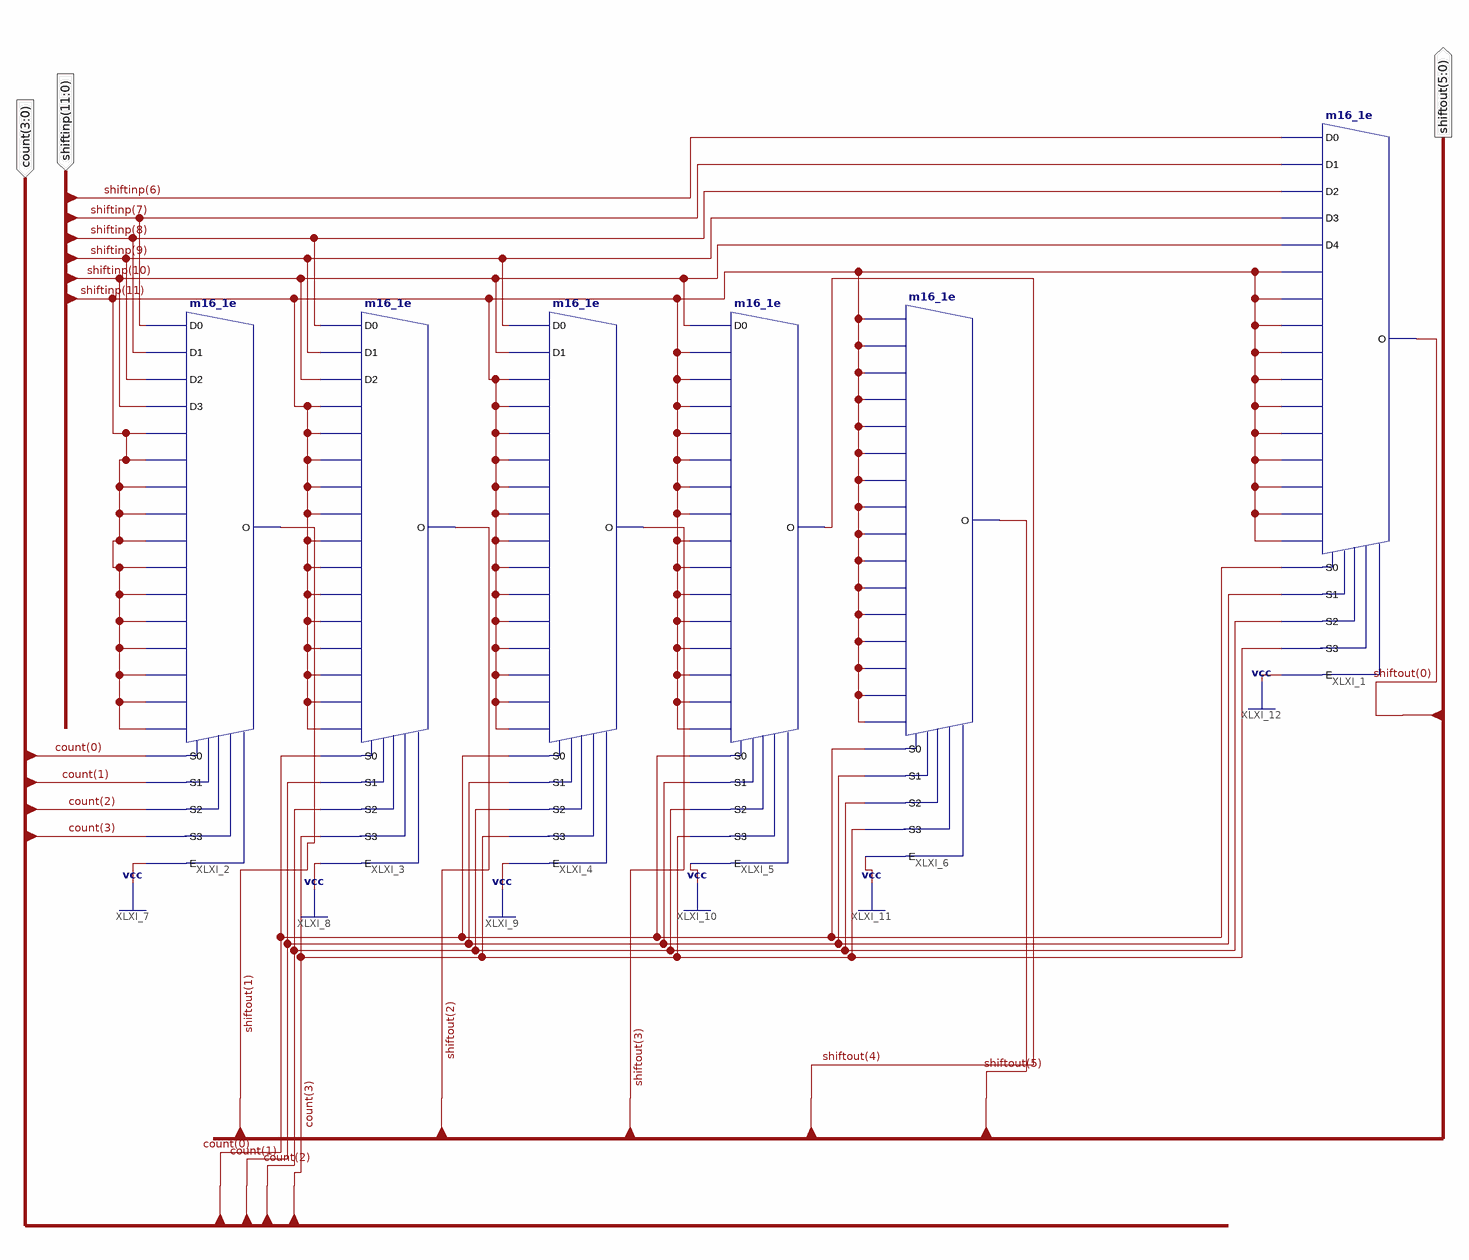
[diagram p0: schematic sheet 1]
// Xilinx ISE schematic shifterhigh.sch (spartan3) as structural Verilog: 6 symbols, 3 ports
module shifterhigh (
  input  [11:0] shiftinp,
  input  [3:0] count,
  output [5:0] shiftout
);

  m16_1e XLXI_1 (
    .D0(shiftinp[6]), .D1(shiftinp[7]), .D10(shiftinp[11]), .D11(shiftinp[11]), .D12(shiftinp[11]),
    .D13(shiftinp[11]), .D14(shiftinp[11]), .D15(shiftinp[11]), .D2(shiftinp[8]), .D3(shiftinp[9]),
    .D4(shiftinp[10]), .D5(shiftinp[11]), .D6(shiftinp[11]), .D7(shiftinp[11]), .D8(shiftinp[11]),
    .D9(shiftinp[11]), .E(1'b1), .S0(count[0]), .S1(count[1]), .S2(count[2]), .S3(count[3]), .O(shiftout[0]));
  m16_1e XLXI_2 (
    .D0(shiftinp[7]), .D1(shiftinp[8]), .D10(shiftinp[11]), .D11(shiftinp[11]), .D12(shiftinp[11]),
    .D13(shiftinp[11]), .D14(shiftinp[11]), .D15(shiftinp[11]), .D2(shiftinp[9]), .D3(shiftinp[10]),
    .D4(shiftinp[11]), .D5(shiftinp[11]), .D6(shiftinp[11]), .D7(shiftinp[11]), .D8(shiftinp[11]),
    .D9(shiftinp[11]), .E(1'b1), .S0(count[0]), .S1(count[1]), .S2(count[2]), .S3(count[3]), .O(shiftout[1]));
  m16_1e XLXI_3 (
    .D0(shiftinp[8]), .D1(shiftinp[9]), .D10(shiftinp[11]), .D11(shiftinp[11]), .D12(shiftinp[11]),
    .D13(shiftinp[11]), .D14(shiftinp[11]), .D15(shiftinp[11]), .D2(shiftinp[10]), .D3(shiftinp[11]),
    .D4(shiftinp[11]), .D5(shiftinp[11]), .D6(shiftinp[11]), .D7(shiftinp[11]), .D8(shiftinp[11]),
    .D9(shiftinp[11]), .E(1'b1), .S0(count[0]), .S1(count[1]), .S2(count[2]), .S3(count[3]), .O(shiftout[2]));
  m16_1e XLXI_4 (
    .D0(shiftinp[9]), .D1(shiftinp[10]), .D10(shiftinp[11]), .D11(shiftinp[11]), .D12(shiftinp[11]),
    .D13(shiftinp[11]), .D14(shiftinp[11]), .D15(shiftinp[11]), .D2(shiftinp[11]), .D3(shiftinp[11]),
    .D4(shiftinp[11]), .D5(shiftinp[11]), .D6(shiftinp[11]), .D7(shiftinp[11]), .D8(shiftinp[11]),
    .D9(shiftinp[11]), .E(1'b1), .S0(count[0]), .S1(count[1]), .S2(count[2]), .S3(count[3]), .O(shiftout[3]));
  m16_1e XLXI_5 (
    .D0(shiftinp[10]), .D1(shiftinp[11]), .D10(shiftinp[11]), .D11(shiftinp[11]), .D12(shiftinp[11]),
    .D13(shiftinp[11]), .D14(shiftinp[11]), .D15(shiftinp[11]), .D2(shiftinp[11]), .D3(shiftinp[11]),
    .D4(shiftinp[11]), .D5(shiftinp[11]), .D6(shiftinp[11]), .D7(shiftinp[11]), .D8(shiftinp[11]),
    .D9(shiftinp[11]), .E(1'b1), .S0(count[0]), .S1(count[1]), .S2(count[2]), .S3(count[3]), .O(shiftout[4]));
  m16_1e XLXI_6 (
    .D0(shiftinp[11]), .D1(shiftinp[11]), .D10(shiftinp[11]), .D11(shiftinp[11]), .D12(shiftinp[11]),
    .D13(shiftinp[11]), .D14(shiftinp[11]), .D15(shiftinp[11]), .D2(shiftinp[11]), .D3(shiftinp[11]),
    .D4(shiftinp[11]), .D5(shiftinp[11]), .D6(shiftinp[11]), .D7(shiftinp[11]), .D8(shiftinp[11]),
    .D9(shiftinp[11]), .E(1'b1), .S0(count[0]), .S1(count[1]), .S2(count[2]), .S3(count[3]), .O(shiftout[5]));
endmodule
